# EAGLE design MILLEFORI (EAGLE 6.6.0)
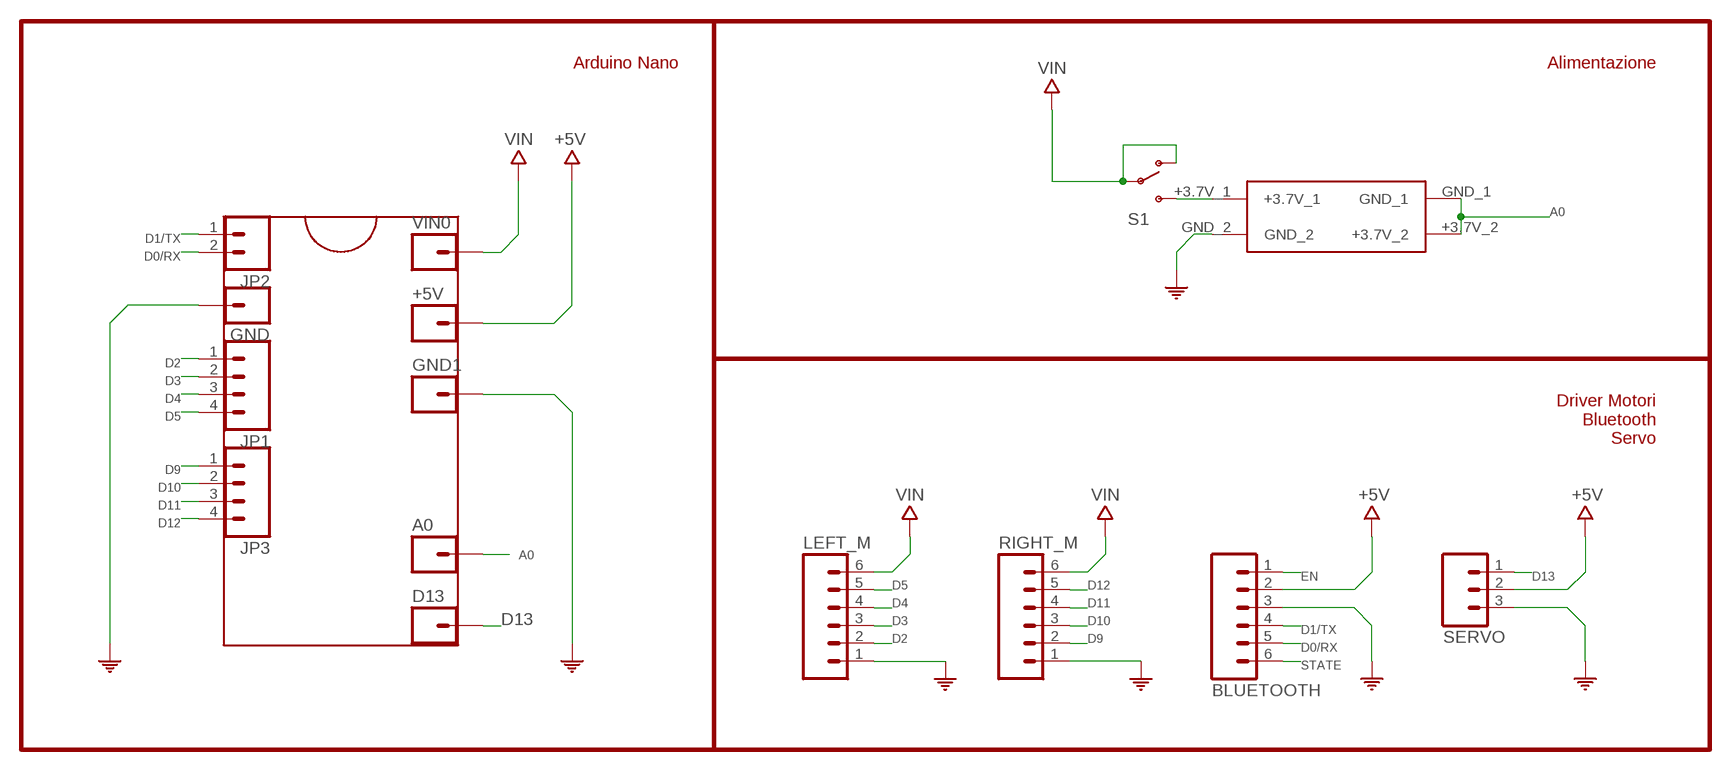
[diagram p0: schematic, sheet 1]

## Parts
+5V  M01PTH  [1X01]
A0  M01PTH  [1X01]
BLUETOOTH  M06SILK_FEMALE_PTH  [1X06]
D13  M01PTH  [1X01]
GND  M01PTH  [1X01]
GND1  M01PTH  [1X01]
JP1  M04PTH  [1X04]
JP2  M02PTH  [1X02]
JP3  M04PTH  [1X04]
LEFT_M  M06SILK_FEMALE_PTH  [1X06]
RIGHT_M  M06SILK_FEMALE_PTH  [1X06]
S1  SWITCH-SPDTPTH_LOCK  [SWITCH-SPDT_LOCK.007S]
SERVO  M03PTH  [1X03]
U$3  18650  [BATTERY_PACK_18650]
VIN0  M01PTH  [1X01]

## Nets
+5V: +5V.1 BLUETOOTH.2 SERVO.2
+7,2V: S1.3(S) U$3.+3.7V_1
A0: A0.1 U$3.+3.7V_2 U$3.GND_1
D0/RX: BLUETOOTH.5 JP2.2
D1/TX: BLUETOOTH.4 JP2.1
D2: JP1.1 LEFT_M.2
D3: JP1.2 LEFT_M.3
D4: JP1.3 LEFT_M.4
D5: JP1.4 LEFT_M.5
D9: JP3.1 RIGHT_M.2
D10: JP3.2 RIGHT_M.3
D11: JP3.3 RIGHT_M.4
D12: JP3.4 RIGHT_M.5
D13: D13.1 SERVO.1
EN: BLUETOOTH.1
GND: BLUETOOTH.3 GND1.1 GND.1 LEFT_M.1 RIGHT_M.1 SERVO.3 U$3.GND_2 ; supply symbol labelled COM
STATE: BLUETOOTH.6
VIN: LEFT_M.6 RIGHT_M.6 S1.1(O) S1.2(P) VIN0.1

## Notes on the sheet
- Arduino Nano | Alimentazione
- Driver Motori
  Bluetooth
  Servo

## Library data of the parts
+5V A0 D13 GND GND1 VIN0 = SparkFun-Connectors:M01: Header 1 Standard 1-pin 0.1" header. Use with straight break away headers (SKU : PRT-00116), right angle break away headers (PRT-00553), swiss pins (PRT-00743), machine pins (PRT-00117), and female headers (PRT-00115).
BLUETOOTH LEFT_M RIGHT_M = SparkFun-Connectors:M06: Header 6 Standard 6-pin 0.1" header. Use with straight break away headers (SKU : PRT-00116), right angle break away headers (PRT-00553), swiss pins (PRT-00743), machine pins (PRT-00117), and female headers (PRT-00115). Molex polarized connector foot print use with SKU : PRT-08094 with associated crimp pins and housings. NOTES ON THE VARIANTS LOCK and LOCK_LONGPADS... This footprint was designed to help hold the alignment of a through-hole component (i.e. 6-pin header) while soldering it into place. You may notice that each hole has been shifted either up or down by 0.005 of an inch from it's more standard position (which is a perfectly straight line). This slight alteration caused the pins (the squares in the middle) to touch the edges of the holes. Because they are alternating, it causes a "brace" to hold the component in place. 0.005 has proven to be the perfect amount of "off-center" position when using our standard breakaway headers. Although looks a little odd when you look at the bare footprint, once you have a header in there, the alteration is very hard to notice. Also,if you push a header all the way into place, it is covered up entirely on the bottom side. This idea of altering the position of holes to aid alignment will be further integrated into the Sparkfun Library for other footprints. It can help hold any component with 3 or more connection pins.; PROD_ID: CONN-08437
JP1 JP3 = SparkFun-Connectors:M04: Header 4 Standard 4-pin 0.1" header. Use with straight break away headers (SKU : PRT-00116), right angle break away headers (PRT-00553), swiss pins (PRT-00743), machine pins (PRT-00117), and female headers (PRT-00115). Molex polarized connector foot print use with SKU : PRT-08231 with associated crimp pins and housings. 1MM SMD Version SKU: PRT-10208
JP2 = SparkFun-Connectors:M02: Standard 2-pin 0.1" header. Use with - straight break away headers ( PRT-00116) - right angle break away headers (PRT-00553) - swiss pins (PRT-00743) - machine pins (PRT-00117) - female headers (PRT-00115) Molex polarized connector foot print use with: PRT-08233 with associated crimp pins and housings. 2.54_SCREWTERM for use with PRT-10571. 3.5mm Screw Terminal footprints for PRT-08084 5mm Screw Terminal footprints for use with PRT-08432
S1 = SparkFun-Electromechanical:SWITCH-SPDT: SPDT Switch Simple slide switch, Spark Fun Electronics SKU : COM-00102 DPDT SMT slide switch, AYZ0202, SWCH-08179
SERVO = SparkFun-Connectors:M03: Header 3 Standard 3-pin 0.1" header. Use with straight break away headers (SKU : PRT-00116), right angle break away headers (PRT-00553), swiss pins (PRT-00743), machine pins (PRT-00117), and female headers (PRT-00115). Molex polarized connector foot print use with SKU : PRT-08232 with associated crimp pins and housings.
U$3 = 18650:18650

## Board
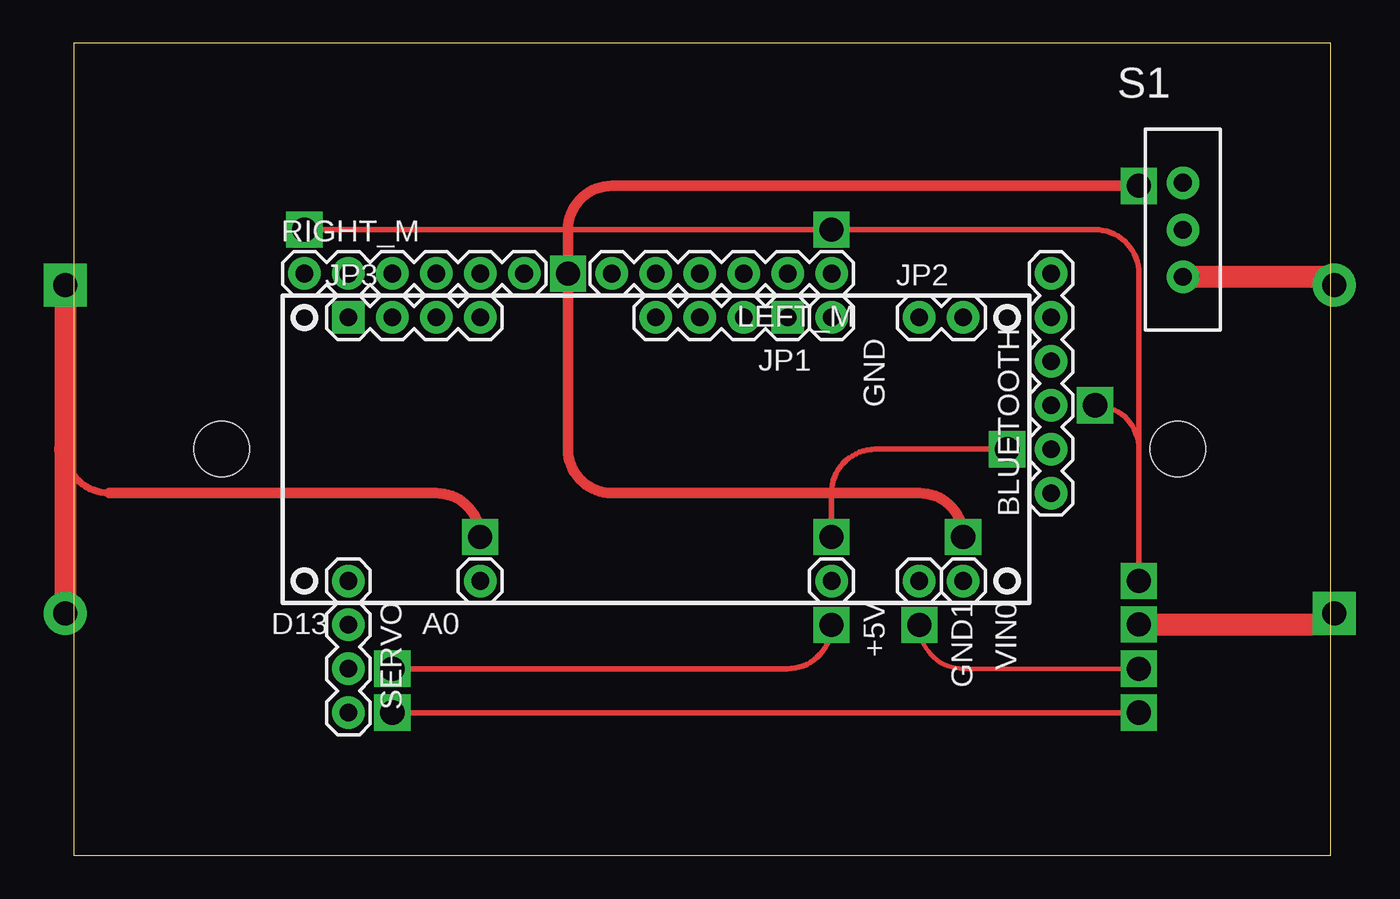
[diagram p1: board, top side]
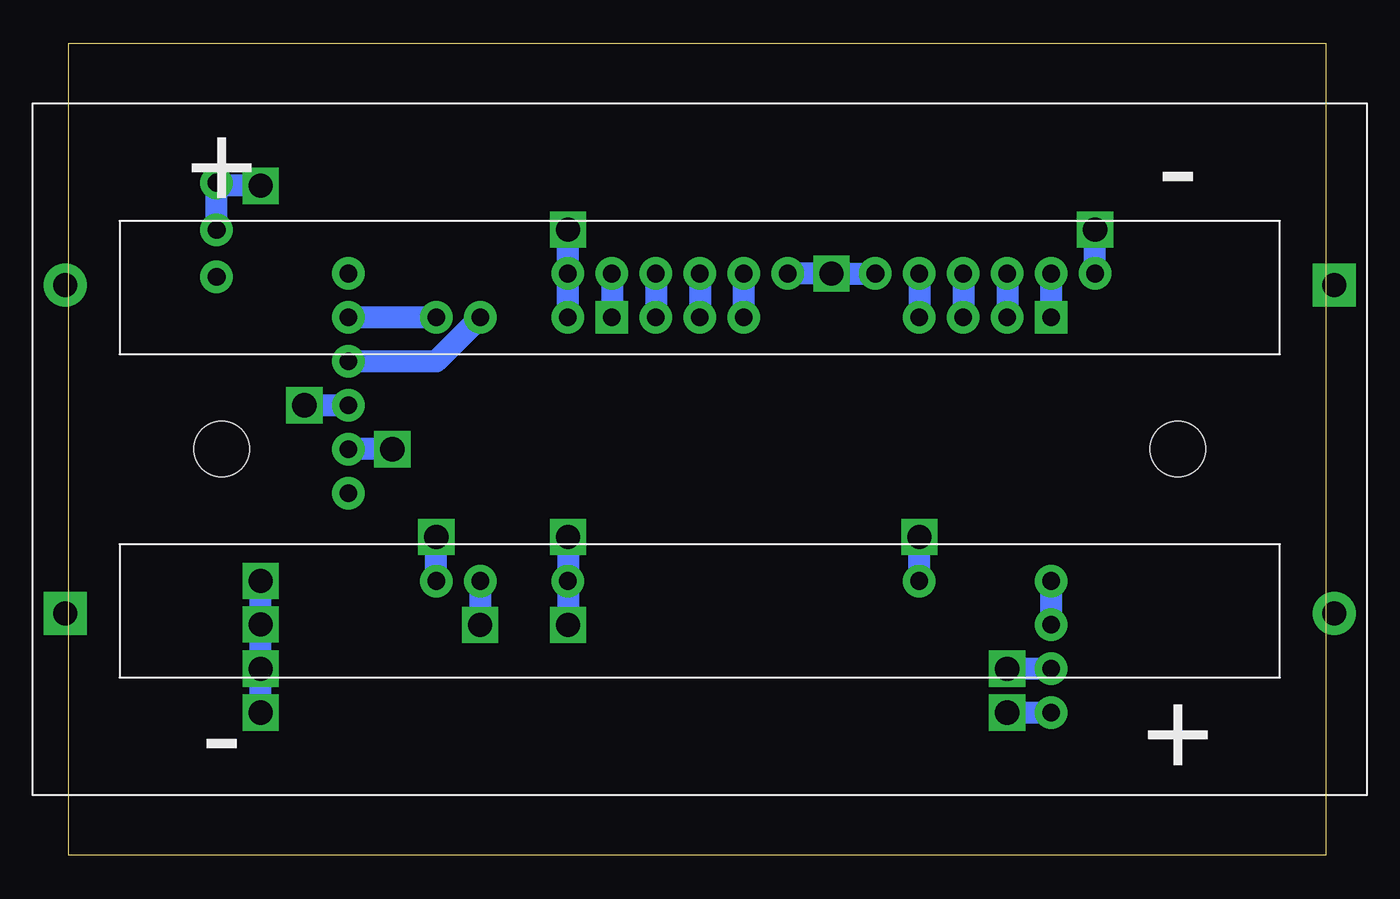
[diagram p2: board, bottom side, seen from below]

Size 72.69 x 46.98 mm. Coordinates in mm from the lower left corner, seen from the top.
Outline: 0,0 72.69,0 72.69,46.98 0,46.98 0,0
Copper layers (1*16): Top 0.035mm / dielectric 1.5mm / Bottom 0.035mm
Design rules "default": minimum track width 10mil, minimum drill 24mil, track to track 8mil, track to pad 8mil, pad to pad 8mil, via to via 8mil, smd to smd 8mil, copper to edge 40mil, drill to drill 8mil, minimum pad ring 10mil, minimum via ring 8mil, stop-mask expansion 4mil, vias tented up to drill 0mil, thermal gap 10mil

### Footprints (pad centres in the part's own frame; a part is rotated, then mirrored left to right if it is on the bottom)
1X01 = drill 1.016 pad 1.88: 1 0,0
1X06 = drill 1.016 pad 1.88: 1 0,0; 2 2.54,0; 3 5.08,0; 4 7.62,0; 5 10.16,0; 6 12.7,0
1X04 = drill 1.016 pad 1.88 square: 1 0,0 | drill 1.016 pad 1.88: 2 2.54,0; 3 5.08,0; 4 7.62,0
1X02 = drill 1.016 pad 1.88: 1 0,0; 2 2.54,0
SWITCH-SPDT_LOCK.007S = drill 1.016 pad 1.88: 1 0,2.718; 2 0,0; 3 0,-2.718
1X03 = drill 1.016 pad 1.88: 1 0,0; 2 2.54,0; 3 5.08,0
BATTERY_PACK_18650 = drill 1.4 pad 2.5: +3.7V_1 36.7,9.5; +3.7V_2 -36.7,-9.5 | drill 1.4 pad 2.5 square: GND_1 -36.7,9.5; GND_2 36.7,-9.5 | hole 3.2: 27.65,0; -27.65,0

### Placement (x,y rotation side)
+5V  43.82,15.88 270 top
A0  23.5,15.88 180 top
BLUETOOTH  56.52,20.96 90 top
D13  15.87,15.88 180 top
GND  43.82,31.12 270 top
GND1  48.9,15.88 270 top
JP1  41.27,31.12 180 top
JP2  48.9,31.12 0 top
JP3  15.87,31.12 0 top
LEFT_M  43.82,33.66 180 top
RIGHT_M  13.33,33.66 0 top
S1  64.13,36.2 0 top
SERVO  15.87,13.33 270 top
U$3  36.2,23.5 0 top
VIN0  51.44,15.88 270 top

### Tracks (layer width: path | path; a pad name or v marks a point on that pad's centre or on a via)
+5V  (via drill 1.4 pad 1.27)
  Top 0.305: v18.41,10.79 41.27,10.79 arc90 v43.82,13.33 | v53.98,23.5 46.36,23.5 arc90 43.82,20.96 v43.82,18.42
  Bottom 1.27: SERVO.2 v18.41,10.79 | v43.82,13.33 +5V.1 v43.82,18.42 | v53.98,23.5 BLUETOOTH.2
+7,2V
  Top 1.27: S1.3 72.41,33.48 arc-90 U$3.+3.7V_1
A0  (via drill 1.4 pad 1.27)
  Top 0.406: 2.04,20.96 arc-90 -0.51,23.5
  Top 0.61: 2.04,20.96 20.95,20.96 arc-90 v23.5,18.42
  Top 1.27: U$3.GND_1 -0.51,23.5 U$3.+3.7V_2
  Bottom 1.27: A0.1 v23.5,18.42
D0/RX
  Bottom 1.27: JP2.2 BLUETOOTH.5
D1/TX
  Bottom 1.27: BLUETOOTH.4 51.44,28.58 JP2.1
D2
  Bottom 1.27: LEFT_M.2 JP1.1
D3
  Bottom 1.27: LEFT_M.3 JP1.2
D4
  Bottom 1.27: LEFT_M.4 JP1.3
D5
  Bottom 1.27: LEFT_M.5 JP1.4
D9
  Bottom 1.27: RIGHT_M.2 JP3.1
D10
  Bottom 1.27: RIGHT_M.3 JP3.2
D11
  Bottom 1.27: RIGHT_M.4 JP3.3
D12
  Bottom 1.27: RIGHT_M.5 JP3.4
D13
  Bottom 1.27: D13.1 SERVO.1
GND  (via drill 1.4 pad 1.27)
  Top 0.254: v48.9,13.33 arc90 51.44,10.79 v61.6,10.79
  Top 0.305: v18.41,8.26 v61.6,8.26 | v13.33,36.2 v43.82,36.2 59.05,36.2 arc-90 61.6,33.66 v61.6,15.88 61.6,23.5 arc90 v59.05,26.04
  Top 1.27: v61.6,13.36 72.26,13.36 arc90 U$3.GND_2
  Bottom 1.27: v61.6,8.26 v61.6,10.79 v61.6,13.36 v61.6,15.88 | GND.1 LEFT_M.1 v43.82,36.2 | RIGHT_M.1 v13.33,36.2 | GND1.1 v48.9,13.33 | SERVO.3 v18.41,8.26 | BLUETOOTH.3 v59.05,26.04
VIN  (via drill 1.4 pad 1.27)
  Top 0.61: v61.6,38.73 31.12,38.73 arc90 28.58,36.2 v28.58,33.66 28.58,23.5 arc90 31.12,20.96 48.9,20.96 arc-90 v51.44,18.42
  Bottom 1.27: LEFT_M.6 v28.58,33.66 RIGHT_M.6 | VIN0.1 v51.44,18.42 | v61.6,38.73 63.96,38.73 arc90 S1.1 S1.2

### Text on the board
tValues: VIN | GND | GND | VIN | D12 | D11 | D10 | D9 | D5 | D4 | D3 | D2 | RX | TX | GND | 5V | VIN | A7 | D13 | 5V | 5V | GND | GND
Document: 1 | 2 | 3 | 4 | 5 | 6 | 7 | 8 | 9 | 10 | 11 | 12 | 13 | 14 | 15 | 16 | 17 | 18 | 19 | 20 | 21 | 22 | 23 | 24 | 25 | O | O | N | N | M | M | L | L | K | K | J | J | I | I | H | H | G | G | F | F | E | E | D | D | C | C | B | B | A | A | 1 | 2 | 3 | 4 | 5 | 6 | 7 | 8 | 9 | 10 | 11 | 12 | 13 | 14 | 15 | 16 | 17 | 18 | 19 | 20 | 21 | 22 | 23 | 24 | 25